# Altium project STM32H743II_V1_18_12.PrjPCB
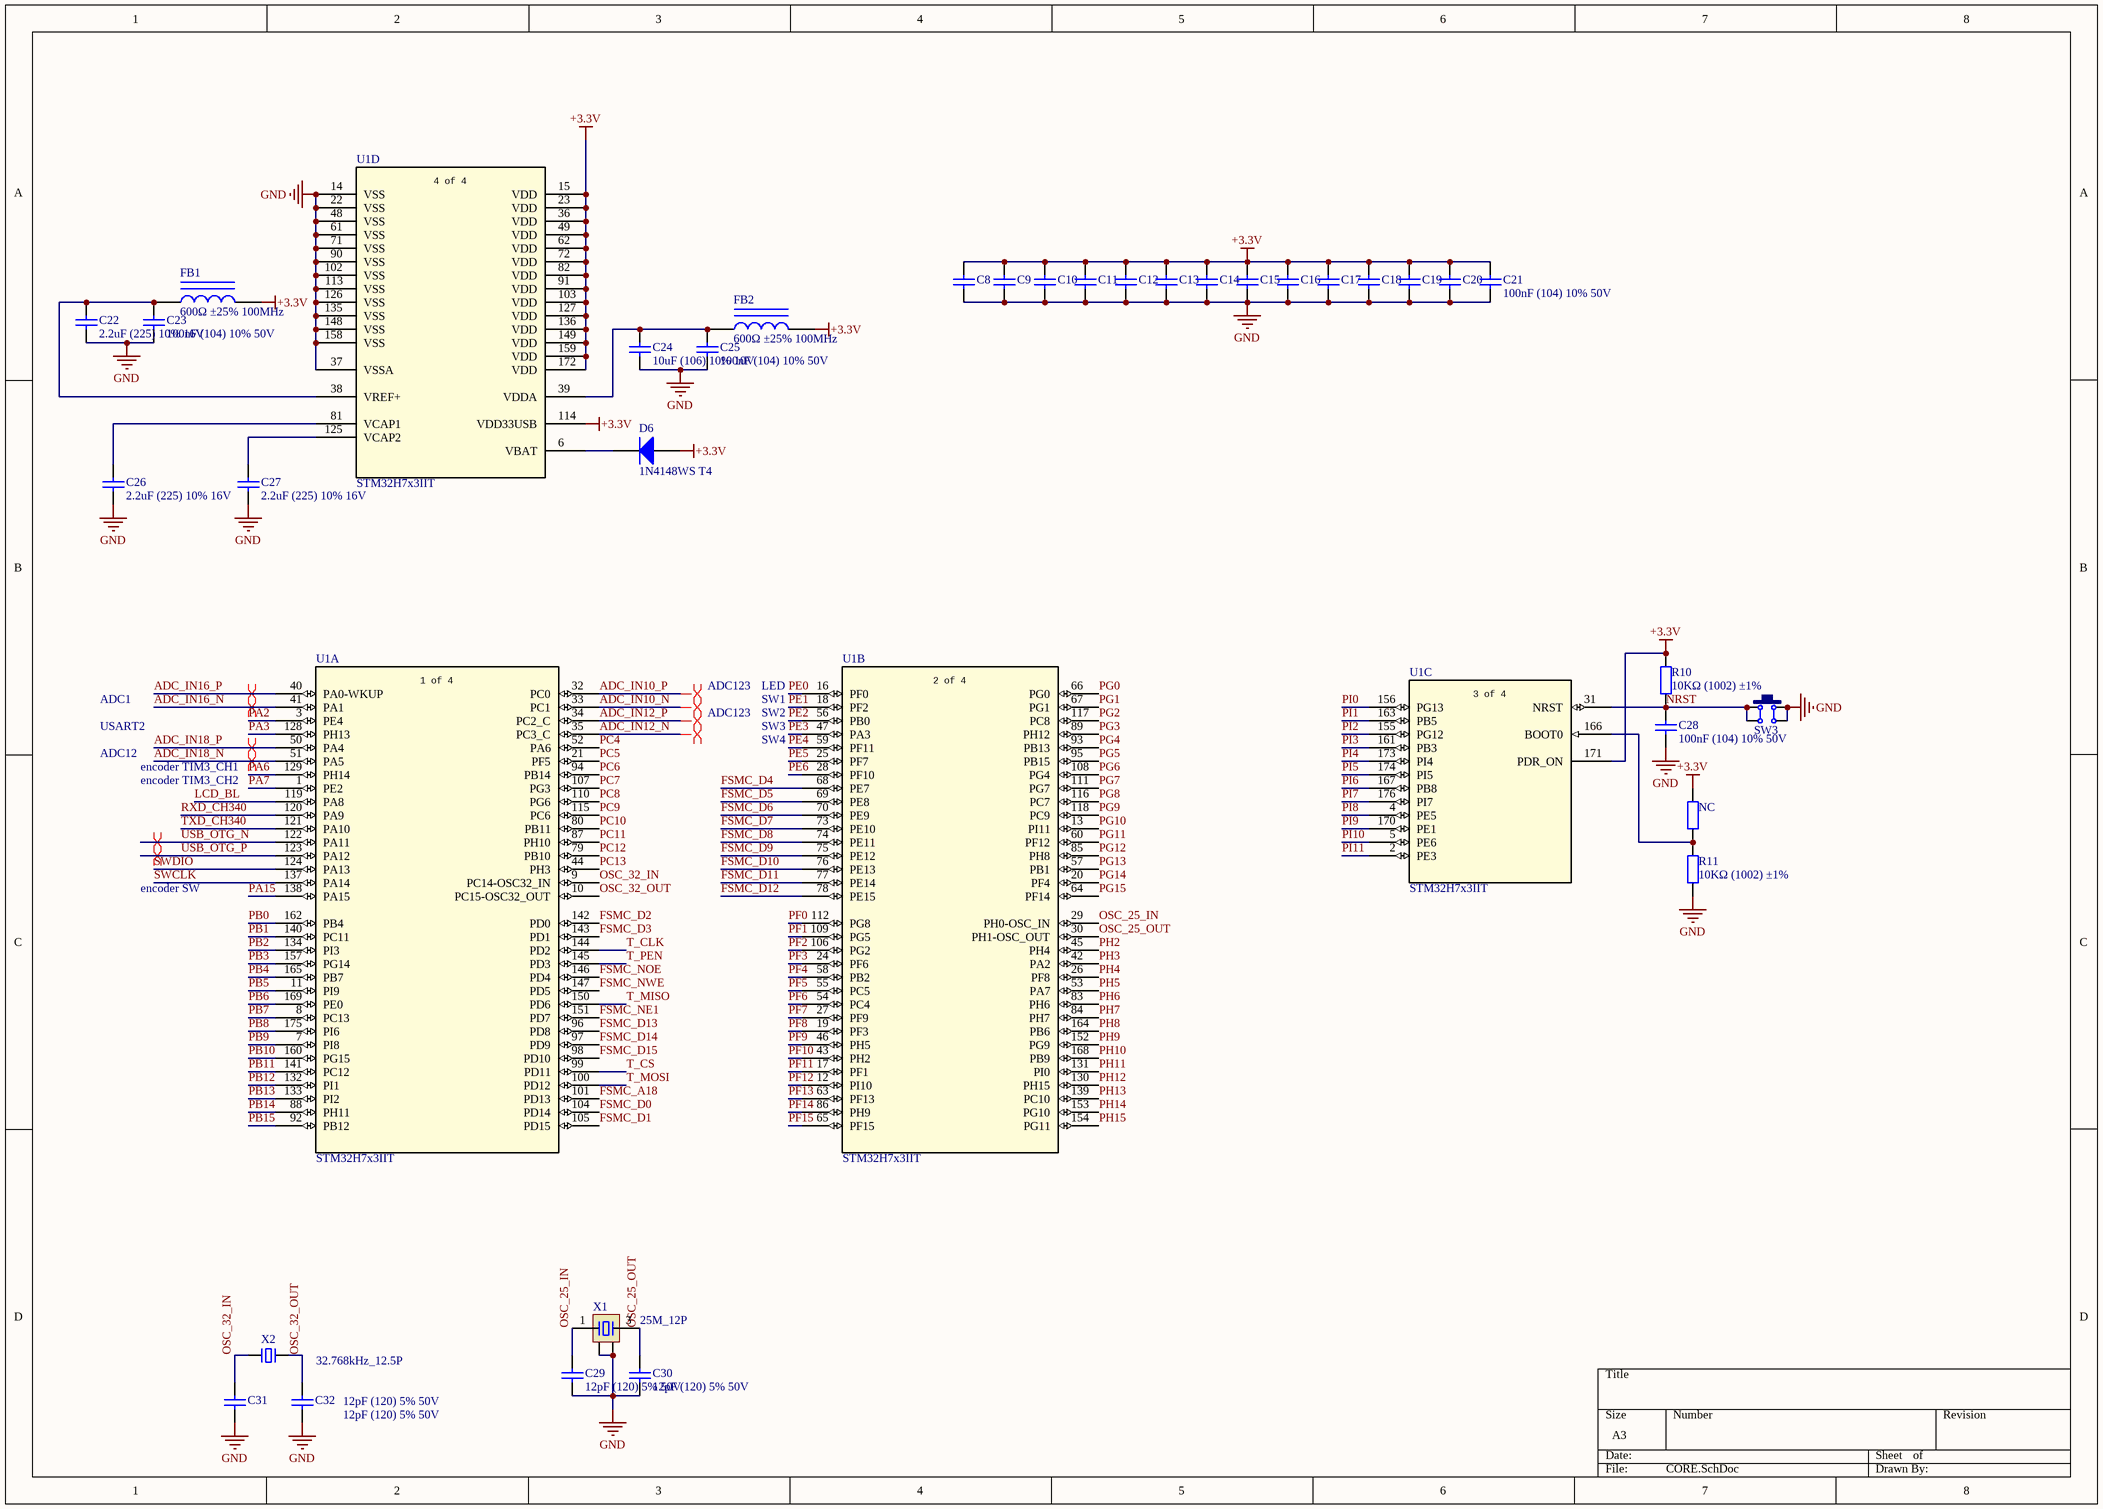
[diagram p0: CORE.SchDoc]
5 sheets, 128 parts. Net scope: global (net labels, ports and power ports of the same name join across sheets).
Board file: STM32H743II.PcbDoc
Sheets:
  CORE.SchDoc
  ST-LINK.SchDoc
  POWER.SchDoc
  CONNECTOR.SchDoc
  DEVICE.SchDoc

## Sheet CORE.SchDoc
size A3

### Parts
C8  100nF (104) 10% 50V  [0603_C]  (value not drawn)
C9  100nF (104) 10% 50V  [0603_C]  (value not drawn)
C10  100nF (104) 10% 50V  [0603_C]  (value not drawn)
C11  100nF (104) 10% 50V  [0603_C]  (value not drawn)
C12  100nF (104) 10% 50V  [0603_C]  (value not drawn)
C13  100nF (104) 10% 50V  [0603_C]  (value not drawn)
C14  100nF (104) 10% 50V  [0603_C]  (value not drawn)
C15  100nF (104) 10% 50V  [0603_C]  (value not drawn)
C16  100nF (104) 10% 50V  [0603_C]  (value not drawn)
C17  100nF (104) 10% 50V  [0603_C]  (value not drawn)
C18  100nF (104) 10% 50V  [0603_C]  (value not drawn)
C19  100nF (104) 10% 50V  [0603_C]  (value not drawn)
C20  100nF (104) 10% 50V  [0603_C]  (value not drawn)
C21  100nF (104) 10% 50V  [0603_C]
C22  2.2uF (225) 10% 16V  [0603_C]
C23  100nF (104) 10% 50V  [0603_C]
C24  10uF (106) 10% 10V  [0603_C]
C25  100nF (104) 10% 50V  [0603_C]
C26  2.2uF (225) 10% 16V  [0603_C]
C27  2.2uF (225) 10% 16V  [0603_C]
C28  100nF (104) 10% 50V  [0603_C]
C29  12pF (120) 5% 50V  [0603_C]
C30  12pF (120) 5% 50V  [0603_C]
C31  12pF (120) 5% 50V  [0603_C]
C32  12pF (120) 5% 50V  [0603_C]
D6  1N4148WS T4  [SOD-323]
FB1  600Ω ±25% 100MHz  [0805_L]
FB2  600Ω ±25% 100MHz  [0805_L]
NC  (no value)  [0603_R]
R10  10KΩ (1002) ±1%  [0603_R]
R11  10KΩ (1002) ±1%  [0603_R]
SW3  6x6x5  [TSW DIP-6*6*6]  (value not drawn)
U1  STM32H7x3IIT  [LQFP176_24x24mm]  (parts A,B,C,D of 4)
X1  25M_12P  [OSC 3225-4P]
X2  32.768kHz_12.5P  [OSC 3215-2P]

### Nets
+3.3V: C8.2 C9.2 C10.2 C11.2 C12.2 C13.2 C14.2 C15.2 C16.2 C17.2 C18.2 C19.2 C20.2 C21.2 D6.1(A) FB1.2 FB2.2 NC.1 R10.2 U1.15(VDD) U1.23(VDD) U1.36(VDD) U1.49(VDD) U1.62(VDD) U1.72(VDD) U1.82(VDD) U1.91(VDD) U1.103(VDD) U1.114(VDD33USB) U1.127(VDD) U1.136(VDD) U1.149(VDD) U1.159(VDD) U1.171(PDR_ON) U1.172(VDD)
GND: C8.1 C9.1 C10.1 C11.1 C12.1 C13.1 C14.1 C15.1 C16.1 C17.1 C18.1 C19.1 C20.1 C21.1 C22.1 C23.1 C24.1 C25.1 C26.1 C27.1 C28.1 C29.1 C30.2 C31.1 C32.1 R11.1 SW3.2 SW3.3 U1.14(VSS) U1.22(VSS) U1.37(VSSA) U1.48(VSS) U1.61(VSS) U1.71(VSS) U1.90(VSS) U1.102(VSS) U1.113(VSS) U1.126(VSS) U1.135(VSS) U1.148(VSS) U1.158(VSS) X1.2 X1.4
ADC_IN10_N: U1.33(PC1)
ADC_IN10_P: U1.32(PC0)
ADC_IN12_N: U1.35(PC3_C)
ADC_IN12_P: U1.34(PC2_C)
ADC_IN16_N: U1.41(PA1)
ADC_IN16_P: U1.40(PA0-WKUP)
ADC_IN18_N: U1.51(PA5)
ADC_IN18_P: U1.50(PA4)
FSMC_A18: U1.101(PD13)
FSMC_D0: U1.104(PD14)
FSMC_D1: U1.105(PD15)
FSMC_D2: U1.142(PD0)
FSMC_D3: U1.143(PD1)
FSMC_D4: U1.68(PE7)
FSMC_D5: U1.69(PE8)
FSMC_D6: U1.70(PE9)
FSMC_D7: U1.73(PE10)
FSMC_D8: U1.74(PE11)
FSMC_D9: U1.75(PE12)
FSMC_D10: U1.76(PE13)
FSMC_D11: U1.77(PE14)
FSMC_D12: U1.78(PE15)
FSMC_D13: U1.96(PD8)
FSMC_D14: U1.97(PD9)
FSMC_D15: U1.98(PD10)
FSMC_NE1: U1.151(PD7)
FSMC_NOE: U1.146(PD4)
FSMC_NWE: U1.147(PD5)
LCD_BL: U1.119(PA8)
NRST: C28.2 R10.1 SW3.1 SW3.4 U1.31(NRST)
OSC_25_IN: C29.2 U1.29(PH0-OSC_IN) X1.1
OSC_25_OUT: C30.1 U1.30(PH1-OSC_OUT) X1.3
OSC_32_IN: C31.2 U1.9(PC14-OSC32_IN) X2.1
OSC_32_OUT: C32.2 U1.10(PC15-OSC32_OUT) X2.2
PA2: U1.3(PE4)
PA3: U1.128(PH13)
PA6: U1.129(PH14)
PA7: U1.1(PE2)
PA15: U1.138(PA15)
PB0: U1.162(PB4)
PB1: U1.140(PC11)
PB2: U1.134(PI3)
PB3: U1.157(PG14)
PB4: U1.165(PB7)
PB5: U1.11(PI9)
PB6: U1.169(PE0)
PB7: U1.8(PC13)
PB8: U1.175(PI6)
PB9: U1.7(PI8)
PB10: U1.160(PG15)
PB11: U1.141(PC12)
PB12: U1.132(PI1)
PB13: U1.133(PI2)
PB14: U1.88(PH11)
PB15: U1.92(PB12)
PC4: U1.52(PA6)
PC5: U1.21(PF5)
PC6: U1.94(PB14)
PC7: U1.107(PG3)
PC8: U1.110(PG6)
PC9: U1.115(PC6)
PC10: U1.80(PB11)
PC11: U1.87(PH10)
PC12: U1.79(PB10)
PC13: U1.44(PH3)
PE0: U1.16(PF0)
PE1: U1.18(PF2)
PE2: U1.56(PB0)
PE3: U1.47(PA3)
PE4: U1.59(PF11)
PE5: U1.25(PF7)
PE6: U1.28(PF10)
PF0: U1.112(PG8)
PF1: U1.109(PG5)
PF2: U1.106(PG2)
PF3: U1.24(PF6)
PF4: U1.58(PB2)
PF5: U1.55(PC5)
PF6: U1.54(PC4)
PF7: U1.27(PF9)
PF8: U1.19(PF3)
PF9: U1.46(PH5)
PF10: U1.43(PH2)
PF11: U1.17(PF1)
PF12: U1.12(PI10)
PF13: U1.63(PF13)
PF14: U1.86(PH9)
PF15: U1.65(PF15)
PG0: U1.66(PG0)
PG1: U1.67(PG1)
PG2: U1.117(PC8)
PG3: U1.89(PH12)
PG4: U1.93(PB13)
PG5: U1.95(PB15)
PG6: U1.108(PG4)
PG7: U1.111(PG7)
PG8: U1.116(PC7)
PG9: U1.118(PC9)
PG10: U1.13(PI11)
PG11: U1.60(PF12)
PG12: U1.85(PH8)
PG13: U1.57(PB1)
PG14: U1.20(PF4)
PG15: U1.64(PF14)
PH2: U1.45(PH4)
PH3: U1.42(PA2)
PH4: U1.26(PF8)
PH5: U1.53(PA7)
PH6: U1.83(PH6)
PH7: U1.84(PH7)
PH8: U1.164(PB6)
PH9: U1.152(PG9)
PH10: U1.168(PB9)
PH11: U1.131(PI0)
PH12: U1.130(PH15)
PH13: U1.139(PC10)
PH14: U1.153(PG10)
PH15: U1.154(PG11)
PI0: U1.156(PG13)
PI1: U1.163(PB5)
PI2: U1.155(PG12)
PI3: U1.161(PB3)
PI4: U1.173(PI4)
PI5: U1.174(PI5)
PI6: U1.167(PB8)
PI7: U1.176(PI7)
PI8: U1.4(PE5)
PI9: U1.170(PE1)
PI10: U1.5(PE6)
PI11: U1.2(PE3)
RXD_CH340: U1.120(PA9)
SWCLK: U1.137(PA14)
SWDIO: U1.124(PA13)
T_CLK: U1.144(PD2)
T_CS: U1.99(PD11)
T_MISO: U1.150(PD6)
T_MOSI: U1.100(PD12)
T_PEN: U1.145(PD3)
TXD_CH340: U1.121(PA10)
USB_OTG_N: U1.122(PA11)
USB_OTG_P: U1.123(PA12)
NetC22_2: C22.2 C23.2 FB1.1 U1.38(VREF+)
NetC24_2: C24.2 C25.2 FB2.1 U1.39(VDDA)
NetC26_2: C26.2 U1.81(VCAP1)
NetC27_2: C27.2 U1.125(VCAP2)
NetD6_2: D6.2(K) U1.6(VBAT)
NetNC_2: NC.2 R11.2 U1.166(BOOT0)

### Layout directives
differential pair: ADC_IN10_N, ADC_IN10_P, ADC_IN12_N, ADC_IN12_P, ADC_IN16_N, ADC_IN16_P, ADC_IN18_N, ADC_IN18_P, USB_OTG_N, USB_OTG_P

### Notes on the sheet
- ADC1
- ADC123
- LED
- SW1
- SW2
- ADC12
- USART2
- encoder TIM3_CH1
- encoder TIM3_CH2
- SW3
- SW4
- encoder SW
- (in symbol STM32H7x3IIT, part A) 1 of 4
- (in symbol STM32H7x3IIT, part B) 2 of 4
- (in symbol STM32H7x3IIT, part C) 3 of 4
- (in symbol STM32H7x3IIT, part D) 4 of 4

### Library data of the parts
C8-C21 C23 C25 C28 = 0603 100nF (104) 10% 50V: 贴片电容; ComponentLink1Description: 供应商链接; ComponentLink1URL: http://www.szlcsc.com/product/details_15331.html; Package: 0603; Supplier: LC; SuppliersPartNumber: C14663
C22 C26 C27 = 0603 2.2uF (225) 10% 16V: 贴片电容; ComponentLink1Description: 供应商链接; ComponentLink1URL: http://www.szlcsc.com/product/details_24366.html; Package: 0603; Supplier: LC; SuppliersPartNumber: C23630
C24 = 0603 10uF (106) 10% 10V: 贴片电容; ComponentLink1Description: 供应商链接; ComponentLink1URL: http://www.szlcsc.com/product/details_20411.html; Package: 0603; Supplier: LC; SuppliersPartNumber: C19702
C29-C32 = 0603 12pF (120) 5% 50V: 贴片电容; ComponentLink1Description: 供应商链接; ComponentLink1URL: http://www.szlcsc.com/product/details_39506.html; Package: 0603; Supplier: LC; SuppliersPartNumber: C38523
D6 = SOD-323 1N4148WS T4: 二极管; ComponentLink1Description: 供应商链接; ComponentLink1URL: http://www.szlcsc.com/product/details_2485.html; Package: SOD-323; Supplier: LC; SuppliersPartNumber: C2128
FB1 FB2 = 0805 600Ω 25% 100MHz: 贴片磁珠; ComponentLink1Description: 供应商链接; ComponentLink1URL: http://www.szlcsc.com/product/details_1369.html; Package: 0805; Supplier: LC; SuppliersPartNumber: C1017
NC = 0603 0Ω (0R0) 1%: 贴片电阻; ComponentLink1Description: 供应商链接; ComponentLink1URL: http://www.szlcsc.com/product/details_21903.html; Package: 0603; Supplier: LC; SuppliersPartNumber: C21189
R10 R11 = 0603 10KΩ (1002) 1%: 贴片电阻; ComponentLink1Description: 供应商链接; ComponentLink1URL: http://www.szlcsc.com/product/details_26547.html; Package: 0603; Supplier: LC; SuppliersPartNumber: C25804
SW3 = TSW DIP-6x6: 直插6x6轻触开关; 版权归属: 源创客; BOM名称: 直插6x6轻触开关; 学习资源: www.ooocke.com
U1 = STM32H7x3IIT: Imported; Vendor: STMicroelectronics; Copyright: Copyright (C) 2016 Accelerated Designs. All rights reserved; Manufacturer_Part_Number: stm32h7x3iit; Value: Value; Type: Type; RefDes: RefDes
X1 = XTAL-4P: 4脚无源晶振; 版权归属: 源创客; BOM名称: 4脚无源晶振; 学习资源: www.ooocke.com
X2 = XTAL-2P: 2脚无源脚晶振; 版权归属: 源创客; BOM名称: 2脚无源脚晶振; 学习资源: www.ooocke.com

## Sheet ST-LINK.SchDoc
size A4
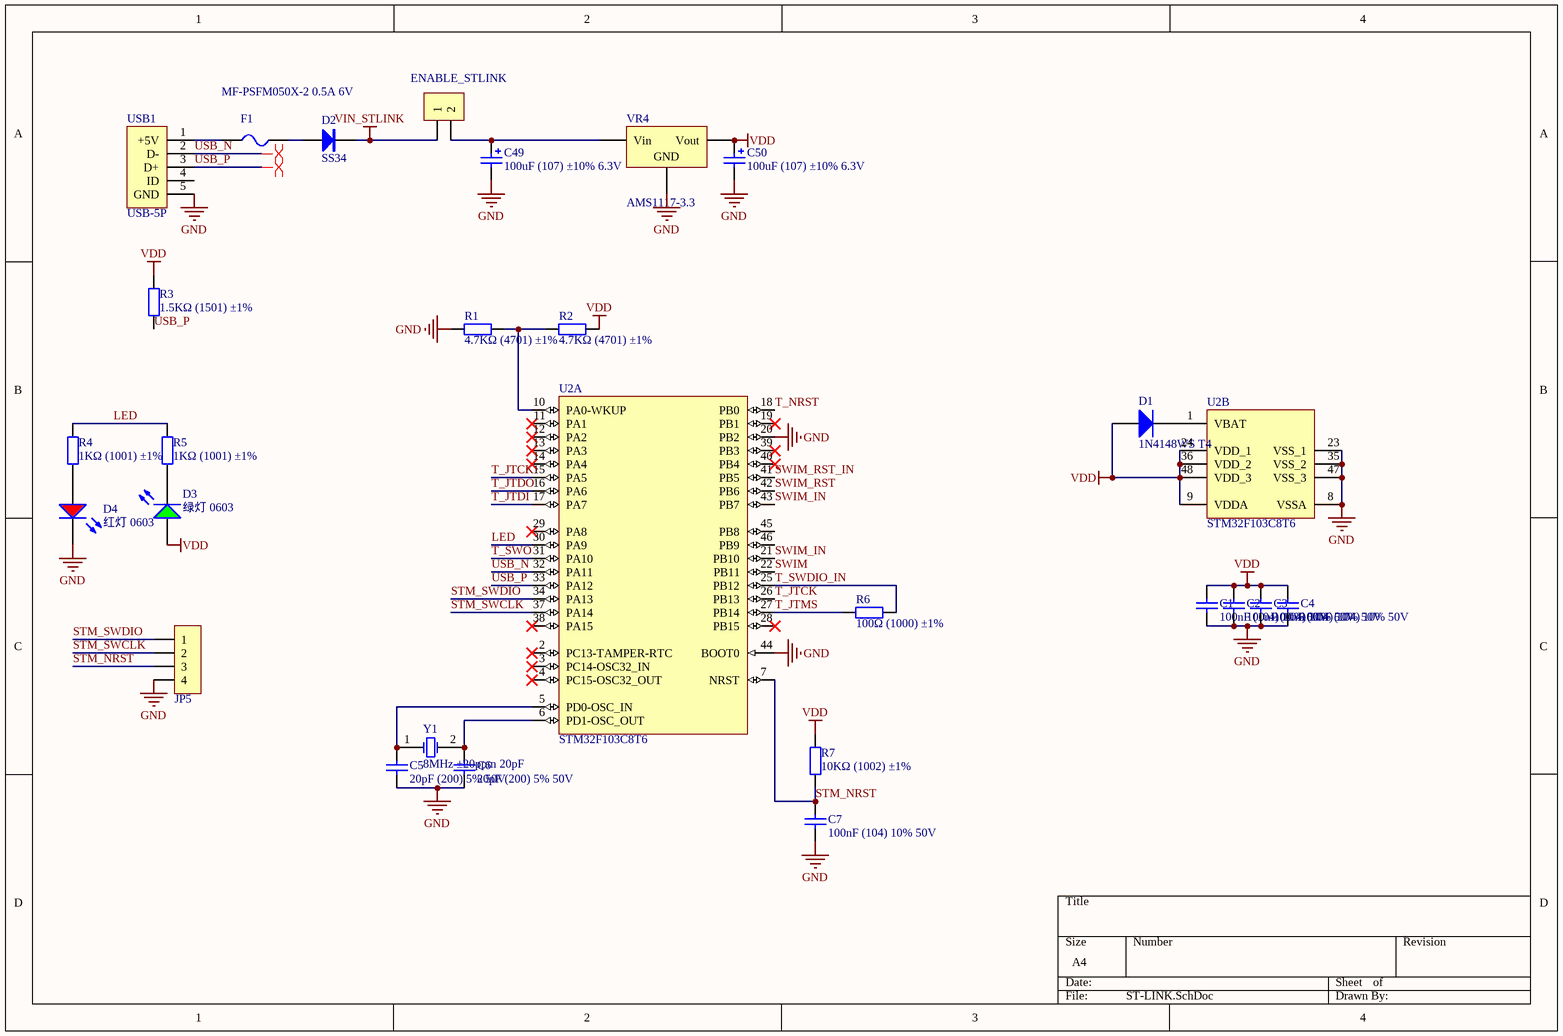
[diagram p1: ST-LINK.SchDoc]

### Parts
C1  100nF (104) 10% 50V  [0603_C]
C2  100nF (104) 10% 50V  [0603_C]
C3  100nF (104) 10% 50V  [0603_C]
C4  100nF (104) 10% 50V  [0603_C]
C5  20pF (200) 5% 50V  [0603_C]
C6  20pF (200) 5% 50V  [0603_C]
C7  100nF (104) 10% 50V  [0603_C]
C49  100uF (107) ±10% 6.3V  [CASE-B_3528]
C50  100uF (107) ±10% 6.3V  [CASE-B_3528]
D1  1N4148WS T4  [SOD-323]
D2  SS34  [SMC]
D3  绿灯 0603  [0603_LED_S1]
D4  红灯 0603  [0603_LED_S1]
ENABLE_STLINK  HDR-1X2  [HDR2.54-LI-2P]  (value not drawn)
F1  MF-PSFM050X-2 0.5A 6V  [FU 0805]
JP5  HDR-1X4  [HDR2.54-LI-4P]  (value not drawn)
R1  4.7KΩ (4701) ±1%  [0603_R]
R2  4.7KΩ (4701) ±1%  [0603_R]
R3  1.5KΩ (1501) ±1%  [0603_R]
R4  1KΩ (1001) ±1%  [0603_R]
R5  1KΩ (1001) ±1%  [0603_R]
R6  100Ω (1000) ±1%  [0603_R]
R7  10KΩ (1002) ±1%  [0603_R]
U2  STM32F103C8T6  [STM-LQFP48_L]  (parts A,B of 2)
USB1  USB-5P  [USB-MICRO_D]
VR4  AMS1117-3.3  [SOT-223]
Y1  8MHz ±20ppm 20pF  [SMD-5032_2P]

### Nets
GND: C1.1 C2.1 C3.1 C4.1 C5.1 C6.1 C7.1 C49.2 C50.2 D4.K JP5.4 R1.1 U2.8(VSSA) U2.20(PB2) U2.23(VSS_1) U2.35(VSS_2) U2.44(BOOT0) U2.47(VSS_3) USB1.5(GND) VR4.1(GND)
VDD: C1.2 C2.2 C3.2 C4.2 C50.1 D1.1(A) D3.A R2.2 R3.2 R7.2 U2.9(VDDA) U2.24(VDD_1) U2.36(VDD_2) U2.48(VDD_3) VR4.2(Vout)
VIN_STLINK: D2.2(K) ENABLE_STLINK.1
LED: R4.2 R5.2 U2.30(PA9)
STM_NRST: C7.2 JP5.3 R7.1 U2.7(NRST)
STM_SWCLK: JP5.2 U2.37(PA14)
STM_SWDIO: JP5.1 U2.34(PA13)
SWIM: U2.22(PB11)
SWIM_IN: U2.21(PB10) U2.43(PB7)
SWIM_RST: U2.42(PB6)
SWIM_RST_IN: U2.41(PB5)
T_JTCK: U2.15(PA5) U2.26(PB13)
T_JTDI: U2.17(PA7)
T_JTDO: U2.16(PA6)
T_JTMS: R6.1 U2.27(PB14)
T_NRST: U2.18(PB0)
T_SWDIO_IN: R6.2 U2.25(PB12)
T_SWO: U2.31(PA10)
USB_N: U2.32(PA11) USB1.2(D-)
USB_P: R3.1 U2.33(PA12) USB1.3(D+)
NetC5_2: C5.2 U2.5(PD0-OSC_IN) Y1.1(OSC1)
NetC6_2: C6.2 U2.6(PD1-OSC_OUT) Y1.2(OSC2)
NetC49_1: C49.1 ENABLE_STLINK.2 VR4.3(Vin)
NetD1_2: D1.2(K) U2.1(VBAT)
NetD2_1: D2.1(A) F1.2
NetD3_K: D3.K R5.1
NetD4_A: D4.A R4.1
NetF1_1: F1.1 USB1.1(+5V)
NetR1_2: R1.2 R2.1 U2.10(PA0-WKUP)

Not connected (* = marked no-connect by the designer): U2 2(PC13-TAMPER-RTC)* 3(PC14-OSC32_IN)* 4(PC15-OSC32_OUT)* 11(PA1)* 12(PA2)* 13(PA3)* 14(PA4)* 19(PB1)* 28(PB15)* 29(PA8)* 38(PA15)* 39(PB3)* 40(PB4)* 45(PB8) 46(PB9); USB1 4(ID)

### Layout directives
differential pair: USB_N, USB_P

### Library data of the parts
C1-C4 C7 = 0603 100nF (104) 10% 50V: 贴片电容; ComponentLink1Description: 供应商链接; ComponentLink1URL: http://www.szlcsc.com/product/details_15331.html; Package: 0603; Supplier: LC; SuppliersPartNumber: C14663
C5 C6 = 0603 20pF (200) 5% 50V: 贴片电容; ComponentLink1Description: 供应商链接; ComponentLink1URL: http://www.szlcsc.com/product/details_2000.html; Package: 0603; Supplier: LC; SuppliersPartNumber: C1648
C49 C50 = 3528 100uF (107) 10% 6.3V: 钽电容; ComponentLink1Description: 供应商链接; ComponentLink1URL: http://www.szlcsc.com/product/details_16815.html; Package: 3528; Supplier: LC; SuppliersPartNumber: C16133
D1 = SOD-323 1N4148WS T4: 二极管; ComponentLink1Description: 供应商链接; ComponentLink1URL: http://www.szlcsc.com/product/details_2485.html; Package: SOD-323; Supplier: LC; SuppliersPartNumber: C2128
D2 = SS34: 肖特基二极管; 版权归属: 源创客; 属性: 40V/3A; BOM名称: 肖特基二极管; 学习资源: www.ooocke.com
D3 = 0603 绿灯: 发光二极管; ComponentLink1Description: 供应商链接; ComponentLink1URL: http://www.szlcsc.com/product/details_73152.html; Package: 0603; Supplier: LC; SuppliersPartNumber: C72043
D4 = 0603 红灯: 发光二极管; ComponentLink1Description: 供应商链接; ComponentLink1URL: http://www.szlcsc.com/product/details_2659.html; Package: 0603; Supplier: LC; SuppliersPartNumber: C2286
ENABLE_STLINK = Header 2: 2P接插件; 版权归属: 源创客; BOM名称: 2P接插件; 学习资源: www.ooocke.com
F1 = FU: 贴片保险丝; 版权归属: 源创客; BOM名称: 贴片保险丝; 学习资源: www.ooocke.com
JP5 = Header 4: 4P接插件; 版权归属: 源创客; BOM名称: 4P接插件; 学习资源: www.ooocke.com
R1 R2 = 0603 4.7KΩ (4701) 1%: 贴片电阻; ComponentLink1Description: 供应商链接; ComponentLink1URL: http://www.szlcsc.com/product/details_23889.html; Package: 0603; Supplier: LC; SuppliersPartNumber: C23162
R3 = 0603 1.5KΩ (1501) 1%: 贴片电阻; ComponentLink1Description: 供应商链接; ComponentLink1URL: http://www.szlcsc.com/product/details_23570.html; Package: 0603; Supplier: LC; SuppliersPartNumber: C22843
R4 R5 = 0603 1KΩ (1001) 1%: 贴片电阻; ComponentLink1Description: 供应商链接; ComponentLink1URL: http://www.szlcsc.com/product/details_21904.html; Package: 0603; Supplier: LC; SuppliersPartNumber: C21190
R6 = 0603 100Ω (1000) 1%: 贴片电阻; ComponentLink1Description: 供应商链接; ComponentLink1URL: http://www.szlcsc.com/product/details_23502.html; Package: 0603; Supplier: LC; SuppliersPartNumber: C22775
R7 = 0603 10KΩ (1002) 1%: 贴片电阻; ComponentLink1Description: 供应商链接; ComponentLink1URL: http://www.szlcsc.com/product/details_26547.html; Package: 0603; Supplier: LC; SuppliersPartNumber: C25804
U2 = CMP-0237-00215-3: ARM Cortex-M3 32-bit MCU, 64 KB Flash, 20 KB Internal RAM, 37 I/Os, 48-pin LQFP, -40 to 85 degC, Tray; Supply Voltage(Vcc) min (V): 2; Internal RAM Size (kB): 20; FLASH Size (Prog) (kB): 64; A/D Converter: 2x12-bit (10 Channel); I/Os (High Current): 37; Operating Frequency(F) (Processor speed) (MHz): 72; Core: ARM Cortex-M3; ComponentLink3Description: Package Specification; Mounting Technology: Surface Mount; PartNumber: STM32F103C8T6; PackageReference: LQFP48; Packing: Tray; ComponentLink3URL: http://www.st.com/st-web-ui/static/active/en/resource/technical/document/datasheet/DM00058181.pdf; DatasheetVersion: Rev. 16; ComponentLink1URL: http://www.st.com/web/en/home.html; PackageVersion: Rev. 6, 06/2013; ComponentLink2URL: http://www.st.com/st-web-ui/static/active/en/resource/technical/document/datasheet/CD00161566.pdf; ComponentLink1Description: Manufacturer URL; ComponentLink2Description: Datasheet; PackageDescription: 48-Pin Low Profile Quad Flat Package, 7 x 7 mm Body, 0.5 mm Pitch; PartId: 1
USB1 = USB-5P: 微型USB母座; 版权归属: 源创客; BOM名称: 微型USB母座; 学习资源: www.ooocke.com
VR4 = SOT-223 AMS1117-3.3: 低压差线性稳压(LDO); ComponentLink1Description: 供应商链接; ComponentLink1URL: http://www.szlcsc.com/product/details_6652.html; Package: SOT-223; Supplier: LC; SuppliersPartNumber: C6186
Y1 = SMD-5032_2P 8MHz 20ppm 20pF: 贴片晶振; ComponentLink1Description: 供应商链接; ComponentLink1URL: http://www.szlcsc.com/product/details_117214.html; Package: SMD-5032_2P; Supplier: LC; SuppliersPartNumber: C115962

## Sheet POWER.SchDoc
size A4
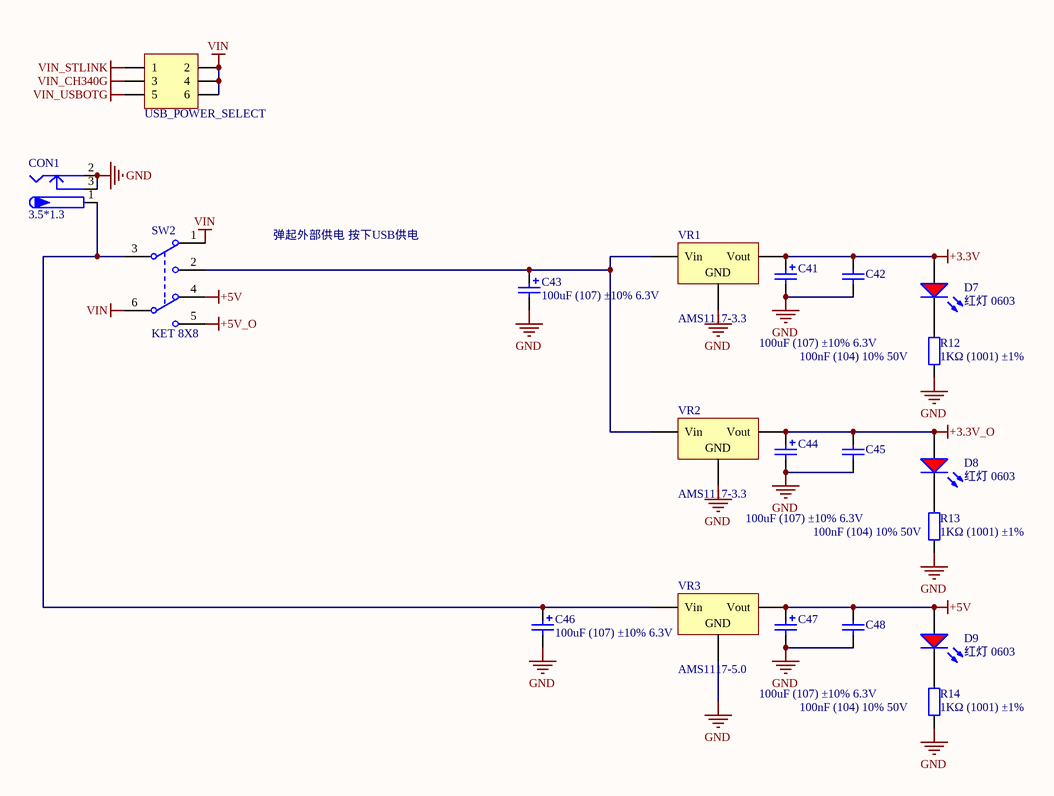
[diagram p2: POWER.SchDoc]

### Parts
C41  100uF (107) ±10% 6.3V  [CASE-B_3528]
C42  100nF (104) 10% 50V  [0603_C]
C43  100uF (107) ±10% 6.3V  [CASE-B_3528]
C44  100uF (107) ±10% 6.3V  [CASE-B_3528]
C45  100nF (104) 10% 50V  [0603_C]
C46  100uF (107) ±10% 6.3V  [CASE-B_3528]
C47  100uF (107) ±10% 6.3V  [CASE-B_3528]
C48  100nF (104) 10% 50V  [0603_C]
CON1  3.5*1.3  [DC-005]
D7  红灯 0603  [0603_LED_S1]
D8  红灯 0603  [0603_LED_S1]
D9  红灯 0603  [0603_LED_S1]
R12  1KΩ (1001) ±1%  [0603_R]
R13  1KΩ (1001) ±1%  [0603_R]
R14  1KΩ (1001) ±1%  [0603_R]
SW2  KET 8X8  [KFT DIP-8X8]
USB_POWER_SELECT  Header3X2  [HDR2.54-LI-2x3P]  (value not drawn)
VR1  AMS1117-3.3  [SOT-223]
VR2  AMS1117-3.3  [SOT-223]
VR3  AMS1117-5.0  [SOT-223]

### Nets
+3.3V: C41.1 C42.2 D7.A VR1.2(Vout)
+3.3V_O: C44.1 C45.2 D8.A VR2.2(Vout)
+5V: C47.1 C48.2 D9.A SW2.4(NO2) VR3.2(Vout)
+5V_O: SW2.5(COM2)
GND: C41.2 C42.1 C43.2 C44.2 C45.1 C46.2 C47.2 C48.1 CON1.2 CON1.3 R12.1 R13.1 R14.1 VR1.1(GND) VR2.1(GND) VR3.1(GND)
VIN: SW2.1(NC1) SW2.6(NC2) USB_POWER_SELECT.2 USB_POWER_SELECT.4 USB_POWER_SELECT.6
VIN_CH340G: USB_POWER_SELECT.3
VIN_STLINK: USB_POWER_SELECT.1
VIN_USBOTG: USB_POWER_SELECT.5
NetC43_1: C43.1 SW2.2(COM2) VR1.3(Vin) VR2.3(Vin)
NetC46_1: C46.1 CON1.1 SW2.3(NO1) VR3.3(Vin)
NetD7_K: D7.K R12.2
NetD8_K: D8.K R13.2
NetD9_K: D9.K R14.2

### Notes on the sheet
- 弹起外部供电 按下USB供电

### Library data of the parts
C41 C43 C44 C46 C47 = 3528 100uF (107) 10% 6.3V: 钽电容; ComponentLink1Description: 供应商链接; ComponentLink1URL: http://www.szlcsc.com/product/details_16815.html; Package: 3528; Supplier: LC; SuppliersPartNumber: C16133
C42 C45 C48 = 0603 100nF (104) 10% 50V: 贴片电容; ComponentLink1Description: 供应商链接; ComponentLink1URL: http://www.szlcsc.com/product/details_15331.html; Package: 0603; Supplier: LC; SuppliersPartNumber: C14663
CON1 = P-DC: 低压电源接口; BOM名称: DC电源接口; 版权归属: 源创客; 学习资源: www.ooocke.com
D7-D9 = 0603 红灯: 发光二极管; ComponentLink1Description: 供应商链接; ComponentLink1URL: http://www.szlcsc.com/product/details_2659.html; Package: 0603; Supplier: LC; SuppliersPartNumber: C2286
R12-R14 = 0603 1KΩ (1001) 1%: 贴片电阻; ComponentLink1Description: 供应商链接; ComponentLink1URL: http://www.szlcsc.com/product/details_21904.html; Package: 0603; Supplier: LC; SuppliersPartNumber: C21190
SW2 = KET 8X8: 8*8自锁开关; 版权归属: 源创客; BOM名称: 8*8自锁开关; 学习资源: www.ooocke.com
USB_POWER_SELECT = Header 3X2: 3*2P接插件; 版权归属: 源创客; BOM名称: 3*2P接插件; 学习资源: www.ooocke.com
VR1 VR2 = SOT-223 AMS1117-3.3: 低压差线性稳压(LDO); ComponentLink1Description: 供应商链接; ComponentLink1URL: http://www.szlcsc.com/product/details_6652.html; Package: SOT-223; Supplier: LC; SuppliersPartNumber: C6186
VR3 = SOT-223 AMS1117-5.0: 低压差线性稳压(LDO); ComponentLink1Description: 供应商链接; ComponentLink1URL: http://www.szlcsc.com/product/details_6653.html; Package: SOT-223; Supplier: LC; SuppliersPartNumber: C6187

## Sheet CONNECTOR.SchDoc
size A4
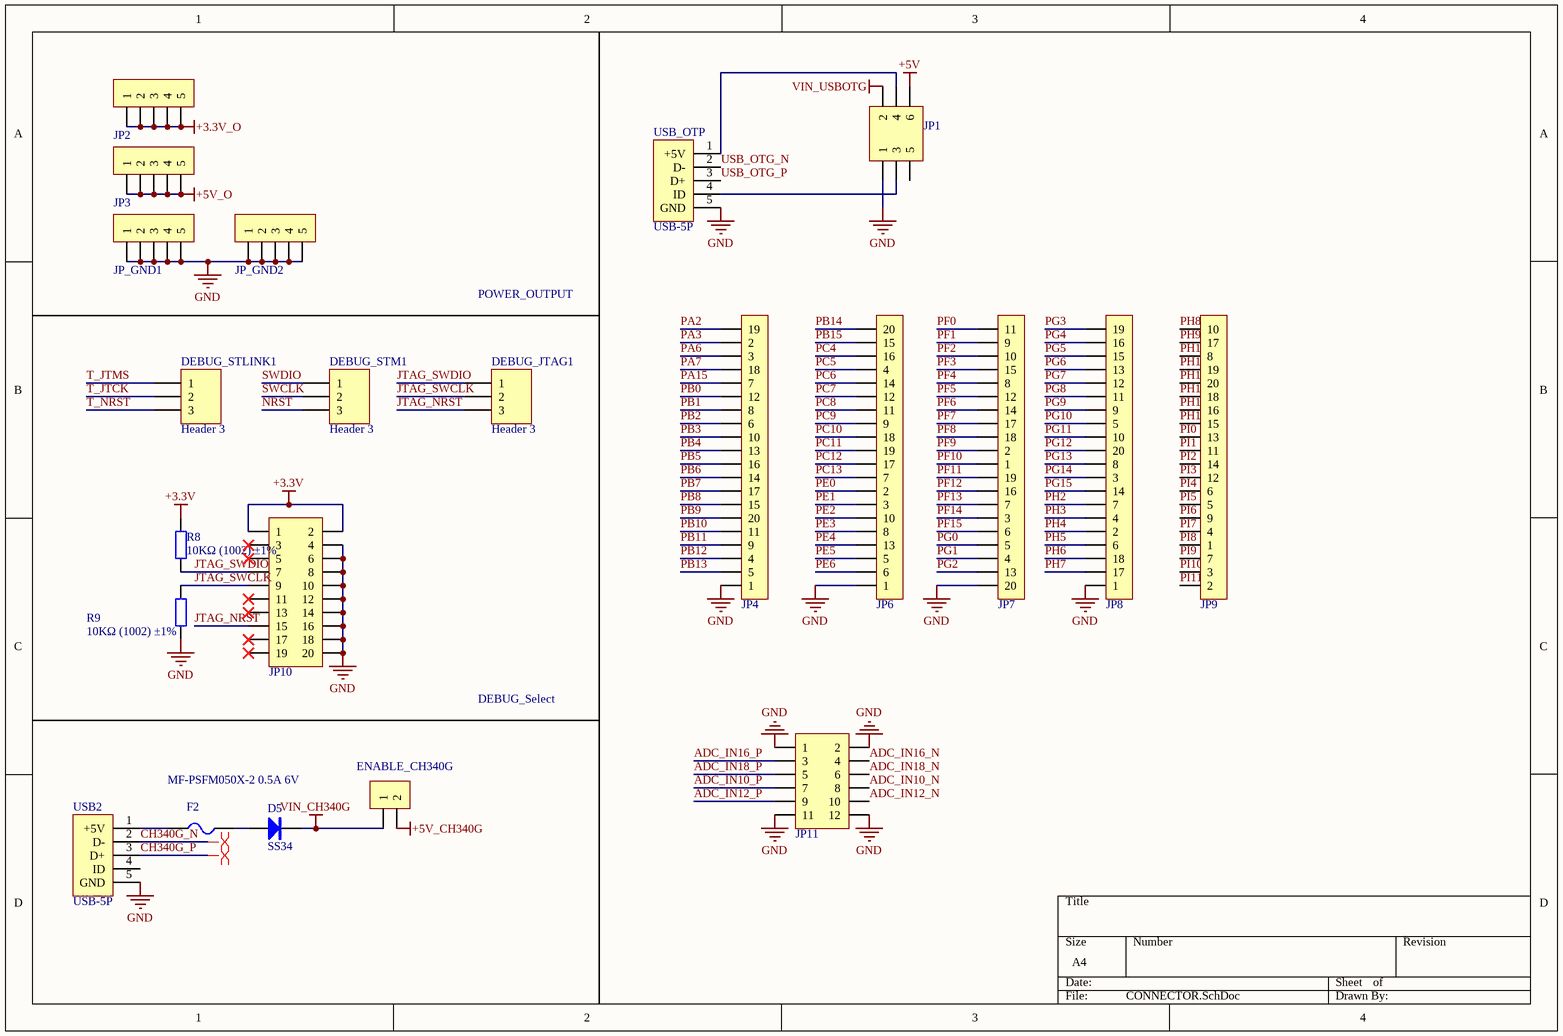
[diagram p3: CONNECTOR.SchDoc]

### Parts
D5  SS34  [SMC]
DEBUG_JTAG1  Header 3  [HDR1X3]
DEBUG_STLINK1  Header 3  [HDR1X3]
DEBUG_STM1  Header 3  [HDR1X3]
ENABLE_CH340G  HDR-1X2  [HDR2.54-LI-2P]  (value not drawn)
F2  MF-PSFM050X-2 0.5A 6V  [FU 0805]
JP1  Header3X2  [HDR2.54-LI-2x3P]  (value not drawn)
JP2  HDR-1X5  [HDR2.54-LI-5P]  (value not drawn)
JP3  HDR-1X5  [HDR2.54-LI-5P]  (value not drawn)
JP4  HDR-1X20  [HDR2.54-LI-20P]  (value not drawn)
JP6  HDR-1X20  [HDR2.54-LI-20P]  (value not drawn)
JP7  HDR-1X20  [HDR2.54-LI-20P]  (value not drawn)
JP8  HDR-1X20  [HDR2.54-LI-20P]  (value not drawn)
JP9  HDR-1X20  [HDR2.54-LI-20P]  (value not drawn)
JP10  Header 2X10  [IDC2.54-LI-2x10P]  (value not drawn)
JP11  Header 6X2  [HDR2.54-LI-2x6P]  (value not drawn)
JP_GND1  HDR-1X5  [HDR2.54-LI-5P]  (value not drawn)
JP_GND2  HDR-1X5  [HDR2.54-LI-5P]  (value not drawn)
R8  10KΩ (1002) ±1%  [0603_R]
R9  10KΩ (1002) ±1%  [0603_R]
USB2  USB-5P  [USB-MICRO_D]
USB_OTP  USB-5P  [USB-MICRO_D]

### Nets
+3.3V: JP10.1 JP10.2 R8.2
+3.3V_O: JP2.1 JP2.2 JP2.3 JP2.4 JP2.5
+5V: JP1.6
+5V_CH340G: ENABLE_CH340G.2
+5V_O: JP3.1 JP3.2 JP3.3 JP3.4 JP3.5
GND: JP1.1 JP4.1 JP6.1 JP7.20 JP8.1 JP10.4 JP10.6 JP10.8 JP10.10 JP10.12 JP10.14 JP10.16 JP10.18 JP10.20 JP11.1 JP11.2 JP11.11 JP11.12 JP_GND1.1 JP_GND1.2 JP_GND1.3 JP_GND1.4 JP_GND1.5 JP_GND2.1 JP_GND2.2 JP_GND2.3 JP_GND2.4 JP_GND2.5 R9.1 USB2.5(GND) USB_OTP.5(GND)
VIN_CH340G: D5.2(K) ENABLE_CH340G.1
VIN_USBOTG: JP1.2
ADC_IN10_N: JP11.8
ADC_IN10_P: JP11.7
ADC_IN12_N: JP11.10
ADC_IN12_P: JP11.9
ADC_IN16_N: JP11.4
ADC_IN16_P: JP11.3
ADC_IN18_N: JP11.6
ADC_IN18_P: JP11.5
CH340G_N: USB2.2(D-)
CH340G_P: USB2.3(D+)
JTAG_NRST: DEBUG_JTAG1.3 JP10.15
JTAG_SWCLK: DEBUG_JTAG1.2 JP10.9 R9.2
JTAG_SWDIO: DEBUG_JTAG1.1 JP10.7 R8.1
NRST: DEBUG_STM1.3
PA2: JP4.19
PA3: JP4.2
PA6: JP4.3
PA7: JP4.18
PA15: JP4.7
PB0: JP4.12
PB1: JP4.8
PB2: JP4.6
PB3: JP4.10
PB4: JP4.13
PB5: JP4.16
PB6: JP4.14
PB7: JP4.17
PB8: JP4.15
PB9: JP4.20
PB10: JP4.11
PB11: JP4.9
PB12: JP4.4
PB13: JP4.5
PB14: JP6.20
PB15: JP6.15
PC4: JP6.16
PC5: JP6.4
PC6: JP6.14
PC7: JP6.12
PC8: JP6.11
PC9: JP6.9
PC10: JP6.18
PC11: JP6.19
PC12: JP6.17
PC13: JP6.7
PE0: JP6.2
PE1: JP6.3
PE2: JP6.10
PE3: JP6.8
PE4: JP6.13
PE5: JP6.5
PE6: JP6.6
PF0: JP7.11
PF1: JP7.9
PF2: JP7.10
PF3: JP7.15
PF4: JP7.8
PF5: JP7.12
PF6: JP7.14
PF7: JP7.17
PF8: JP7.18
PF9: JP7.2
PF10: JP7.1
PF11: JP7.19
PF12: JP7.16
PF13: JP7.7
PF14: JP7.3
PF15: JP7.6
PG0: JP7.5
PG1: JP7.4
PG2: JP7.13
PG3: JP8.19
PG4: JP8.16
PG5: JP8.15
PG6: JP8.13
PG7: JP8.12
PG8: JP8.11
PG9: JP8.9
PG10: JP8.5
PG11: JP8.10
PG12: JP8.20
PG13: JP8.8
PG14: JP8.3
PG15: JP8.14
PH2: JP8.7
PH3: JP8.4
PH4: JP8.2
PH5: JP8.6
PH6: JP8.18
PH7: JP8.17
PH8: JP9.10
PH9: JP9.17
PH10: JP9.8
PH11: JP9.19
PH12: JP9.20
PH13: JP9.18
PH14: JP9.16
PH15: JP9.15
PI0: JP9.13
PI1: JP9.11
PI2: JP9.14
PI3: JP9.12
PI4: JP9.6
PI5: JP9.5
PI6: JP9.9
PI7: JP9.4
PI8: JP9.1
PI9: JP9.7
PI10: JP9.3
PI11: JP9.2
SWCLK: DEBUG_STM1.2
SWDIO: DEBUG_STM1.1
T_JTCK: DEBUG_STLINK1.2
T_JTMS: DEBUG_STLINK1.1
T_NRST: DEBUG_STLINK1.3
USB_OTG_N: USB_OTP.2(D-)
USB_OTG_P: USB_OTP.3(D+)
NetD5_1: D5.1(A) F2.2
NetF2_1: F2.1 USB2.1(+5V)
NetJP1_3: JP1.3 USB_OTP.4(ID)
NetJP1_4: JP1.4 USB_OTP.1(+5V)

Not connected (* = marked no-connect by the designer): JP1 5; JP10 3* 5* 11* 13* 17* 19*; USB2 4(ID)

### Layout directives
differential pair: CH340G_N, CH340G_P

### Notes on the sheet
- POWER_OUTPUT
- DEBUG_Select

### Library data of the parts
D5 = SS34: 肖特基二极管; 版权归属: 源创客; 属性: 40V/3A; BOM名称: 肖特基二极管; 学习资源: www.ooocke.com
DEBUG_JTAG1 DEBUG_STLINK1 DEBUG_STM1 = Header 3: Header, 3-Pin; LatestRevisionDate: 17-Jul-2002; LatestRevisionNote: Re-released for DXP Platform.; Publisher: Altium Limited
ENABLE_CH340G = Header 2: 2P接插件; 版权归属: 源创客; BOM名称: 2P接插件; 学习资源: www.ooocke.com
F2 = FU: 贴片保险丝; 版权归属: 源创客; BOM名称: 贴片保险丝; 学习资源: www.ooocke.com
JP1 = Header 3X2: 3*2P接插件; 版权归属: 源创客; BOM名称: 3*2P接插件; 学习资源: www.ooocke.com
JP2 JP3 JP_GND1 JP_GND2 = Header 5: 5P接插件; 版权归属: 源创客; BOM名称: 5P接插件; 学习资源: www.ooocke.com
JP4 JP6-JP9 = Header 20: 20P接插件; 版权归属: 源创客; BOM名称: 20P接插件; 学习资源: www.ooocke.com
JP10 = Header 10X2: 10*2P接插件; 版权归属: 源创客; BOM名称: 10*2P接插件; 学习资源: www.ooocke.com
JP11 = Header  6X2: 6*2P接插件; 版权归属: 源创客; BOM名称: 6*2P接插件; 学习资源: www.ooocke.com
R8 R9 = 0603 10KΩ (1002) 1%: 贴片电阻; ComponentLink1Description: 供应商链接; ComponentLink1URL: http://www.szlcsc.com/product/details_26547.html; Package: 0603; Supplier: LC; SuppliersPartNumber: C25804
USB2 USB_OTP = USB-5P: 微型USB母座; 版权归属: 源创客; BOM名称: 微型USB母座; 学习资源: www.ooocke.com

## Sheet DEVICE.SchDoc
size A4
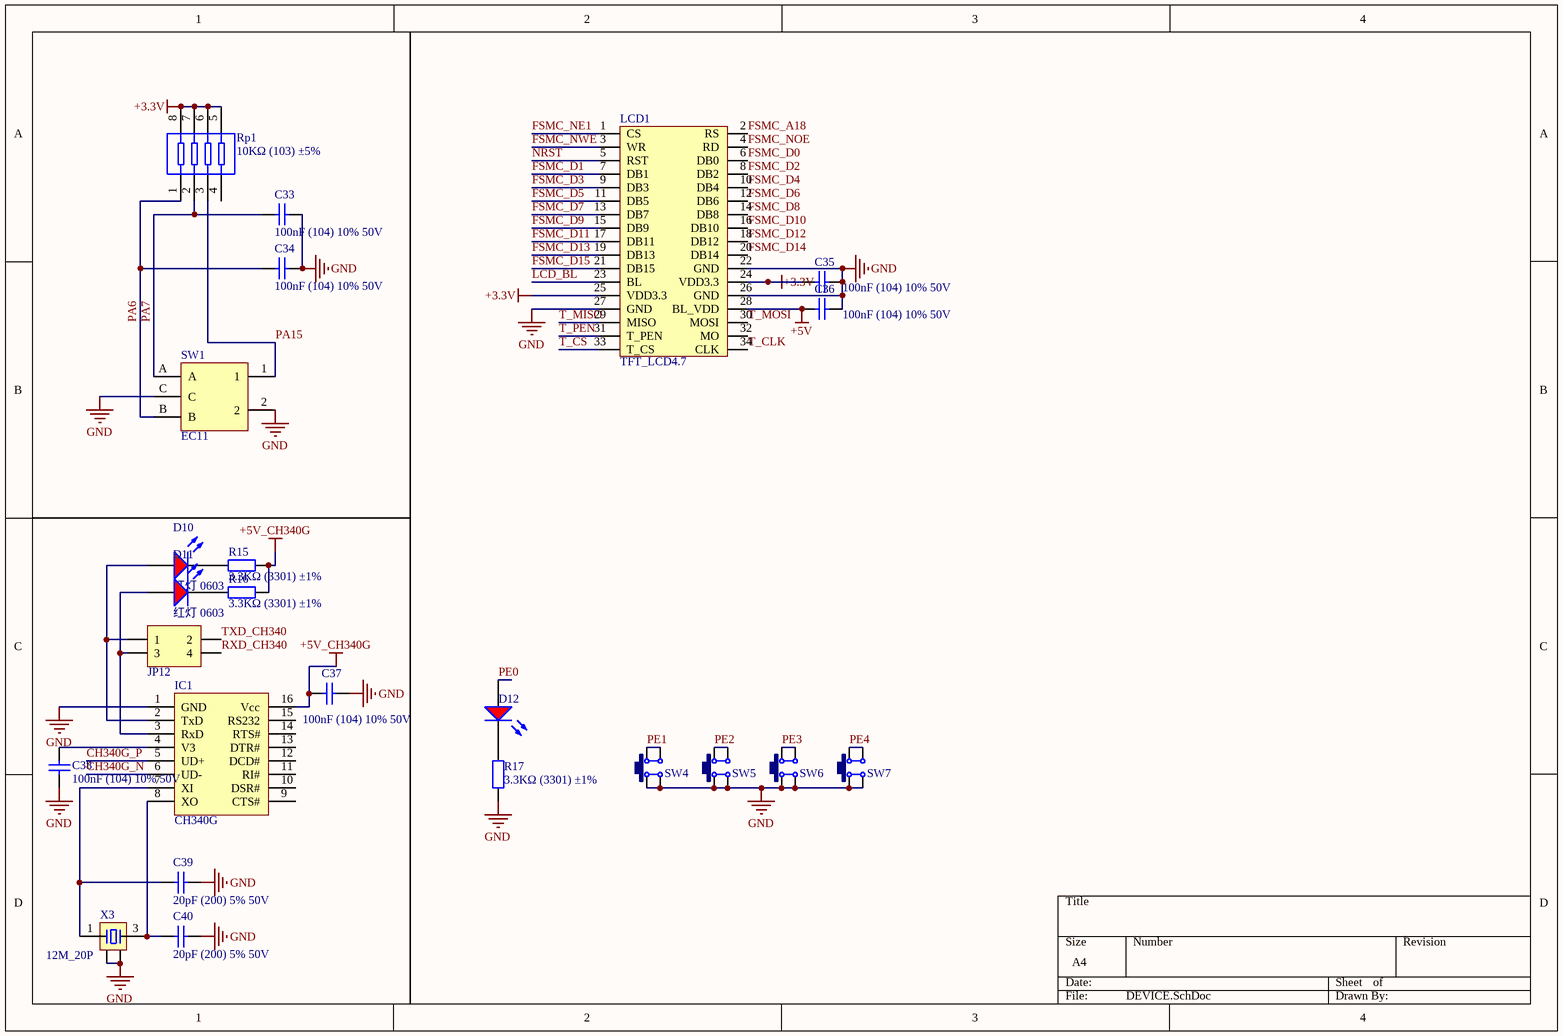
[diagram p4: DEVICE.SchDoc]

### Parts
C33  100nF (104) 10% 50V  [0603_C]
C34  100nF (104) 10% 50V  [0603_C]
C35  100nF (104) 10% 50V  [0603_C]
C36  100nF (104) 10% 50V  [0603_C]
C37  100nF (104) 10% 50V  [0603_C]
C38  100nF (104) 10% 50V  [0603_C]
C39  20pF (200) 5% 50V  [0603_C]
C40  20pF (200) 5% 50V  [0603_C]
D10  红灯 0603  [0603_LED_S1]
D11  红灯 0603  [0603_LED_S1]
D12  红灯 0603  [0603_LED_S1]  (value not drawn)
IC1  CH340G  [SOP16_L]
JP12  Header2X2  [HDR2.54-LI-2x2P]  (value not drawn)
LCD1  TFT_LCD4.7  [DB2*17-3.5]
R15  3.3KΩ (3301) ±1%  [0603_R]
R16  3.3KΩ (3301) ±1%  [0603_R]
R17  3.3KΩ (3301) ±1%  [0603_R]
Rp1  10KΩ (103) ±5%  [0603_Rx4]
SW1  EC11  [EC11-B]
SW4  6x6x5  [TSW DIP-6*6*6]  (value not drawn)
SW5  6x6x5  [TSW DIP-6*6*6]  (value not drawn)
SW6  6x6x5  [TSW DIP-6*6*6]  (value not drawn)
SW7  6x6x5  [TSW DIP-6*6*6]  (value not drawn)
X3  12M_20P  [OSC 3225-4P]

### Nets
+3.3V: C35.1 LCD1.24(VDD3.3) LCD1.25(VDD3.3) Rp1.5 Rp1.6 Rp1.7 Rp1.8
+5V: C36.2 LCD1.28(BL_VDD)
+5V_CH340G: C37.1 IC1.16(Vcc) R15.2 R16.2
GND: C33.1 C34.1 C35.2 C36.1 C37.2 C38.2 C39.1 C40.1 IC1.1(GND) LCD1.22(GND) LCD1.26(GND) LCD1.27(GND) R17.1 SW1.2 SW1.C SW4.1 SW4.4 SW5.1 SW5.4 SW6.1 SW6.4 SW7.1 SW7.4 X3.2 X3.4
CH340G_N: IC1.6(UD-)
CH340G_P: IC1.5(UD+)
FSMC_A18: LCD1.2(RS)
FSMC_D0: LCD1.6(DB0)
FSMC_D1: LCD1.7(DB1)
FSMC_D2: LCD1.8(DB2)
FSMC_D3: LCD1.9(DB3)
FSMC_D4: LCD1.10(DB4)
FSMC_D5: LCD1.11(DB5)
FSMC_D6: LCD1.12(DB6)
FSMC_D7: LCD1.13(DB7)
FSMC_D8: LCD1.14(DB8)
FSMC_D9: LCD1.15(DB9)
FSMC_D10: LCD1.16(DB10)
FSMC_D11: LCD1.17(DB11)
FSMC_D12: LCD1.18(DB12)
FSMC_D13: LCD1.19(DB13)
FSMC_D14: LCD1.20(DB14)
FSMC_D15: LCD1.21(DB15)
FSMC_NE1: LCD1.1(CS)
FSMC_NOE: LCD1.4(RD)
FSMC_NWE: LCD1.3(WR)
LCD_BL: LCD1.23(BL)
NRST: LCD1.5(RST)
PA6: C34.2 Rp1.1 SW1.B
PA7: C33.2 Rp1.2 SW1.A
PA15: Rp1.3 SW1.1
PE0: D12.A
PE1: SW4.2 SW4.3
PE2: SW5.2 SW5.3
PE3: SW6.2 SW6.3
PE4: SW7.2 SW7.3
RXD_CH340: JP12.4
T_CLK: LCD1.34(CLK)
T_CS: LCD1.33(T_CS)
T_MISO: LCD1.29(MISO)
T_MOSI: LCD1.30(MOSI)
T_PEN: LCD1.31(T_PEN)
TXD_CH340: JP12.2
NetC38_1: C38.1 IC1.4(V3)
NetC39_2: C39.2 IC1.7(XI) X3.1
NetC40_2: C40.2 IC1.8(XO) X3.3
NetD10_A: D10.A IC1.2(TxD) JP12.1
NetD10_K: D10.K R15.1
NetD11_A: D11.A IC1.3(RxD) JP12.3
NetD11_K: D11.K R16.1
NetD12_K: D12.K R17.2

Not connected (* = marked no-connect by the designer): IC1 9(CTS#) 10(DSR#) 11(RI#) 12(DCD#) 13(DTR#) 14(RTS#) 15(RS232); LCD1 32(MO); Rp1 4

### Library data of the parts
C33-C38 = 0603 100nF (104) 10% 50V: 贴片电容; ComponentLink1Description: 供应商链接; ComponentLink1URL: http://www.szlcsc.com/product/details_15331.html; Package: 0603; Supplier: LC; SuppliersPartNumber: C14663
C39 C40 = 0603 20pF (200) 5% 50V: 贴片电容; ComponentLink1Description: 供应商链接; ComponentLink1URL: http://www.szlcsc.com/product/details_2000.html; Package: 0603; Supplier: LC; SuppliersPartNumber: C1648
D10-D12 = 0603 红灯: 发光二极管; ComponentLink1Description: 供应商链接; ComponentLink1URL: http://www.szlcsc.com/product/details_2659.html; Package: 0603; Supplier: LC; SuppliersPartNumber: C2286
IC1 = CH340G: 串口转USB; 版权归属: 源创客; BOM名称: 串口转USB; 学习资源: www.ooocke.com
JP12 = Header 2X2: 2*2P接插件; 版权归属: 源创客; BOM名称: 2*2P接插件; 学习资源: www.ooocke.com
R15-R17 = 0603 3.3KΩ (3301) 1%: 贴片电阻; ComponentLink1Description: 供应商链接; ComponentLink1URL: http://www.szlcsc.com/product/details_23705.html; Package: 0603; Supplier: LC; SuppliersPartNumber: C22978
Rp1 = 0603*4  10KΩ (103) 5%: 贴片排阻; ComponentLink1Description: 供应商链接; ComponentLink1URL: http://www.szlcsc.com/product/details_30472.html; Package: 0603*4; Supplier: LC; SuppliersPartNumber: C29718
SW1 = EC11: 数字开关编码器; BOM名称: 数字编码开关; 版权归属: 源创客; 学习资源: www.ooocke.com
SW4-SW7 = TSW DIP-6x6: 直插6x6轻触开关; 版权归属: 源创客; BOM名称: 直插6x6轻触开关; 学习资源: www.ooocke.com
X3 = XTAL-4P: 4脚无源晶振; 版权归属: 源创客; BOM名称: 4脚无源晶振; 学习资源: www.ooocke.com

## Nets that join several sheets
+3.3V: CORE (35 pins), POWER (C41.1 C42.2 D7.A VR1.2), CONNECTOR (JP10.1 JP10.2 R8.2), DEVICE (7 pins)
+3.3V_O: POWER (C44.1 C45.2 D8.A VR2.2), CONNECTOR (5 pins)
+5V: POWER (5 pins), CONNECTOR (JP1.6), DEVICE (C36.2 LCD1.28)
+5V_CH340G: CONNECTOR (ENABLE_CH340G.2), DEVICE (C37.1 IC1.16 R15.2 R16.2)
+5V_O: POWER (SW2.5), CONNECTOR (5 pins)
GND: CORE (43 pins), ST-LINK (20 pins), POWER (16 pins), CONNECTOR (31 pins), DEVICE (25 pins)
VIN_CH340G: POWER (USB_POWER_SELECT.3), CONNECTOR (D5.2 ENABLE_CH340G.1)
VIN_STLINK: ST-LINK (D2.2 ENABLE_STLINK.1), POWER (USB_POWER_SELECT.1)
VIN_USBOTG: POWER (USB_POWER_SELECT.5), CONNECTOR (JP1.2)
ADC_IN10_N: CORE (U1.33), CONNECTOR (JP11.8)
ADC_IN10_P: CORE (U1.32), CONNECTOR (JP11.7)
ADC_IN12_N: CORE (U1.35), CONNECTOR (JP11.10)
ADC_IN12_P: CORE (U1.34), CONNECTOR (JP11.9)
ADC_IN16_N: CORE (U1.41), CONNECTOR (JP11.4)
ADC_IN16_P: CORE (U1.40), CONNECTOR (JP11.3)
ADC_IN18_N: CORE (U1.51), CONNECTOR (JP11.6)
ADC_IN18_P: CORE (U1.50), CONNECTOR (JP11.5)
CH340G_N: CONNECTOR (USB2.2), DEVICE (IC1.6)
CH340G_P: CONNECTOR (USB2.3), DEVICE (IC1.5)
FSMC_A18: CORE (U1.101), DEVICE (LCD1.2)
FSMC_D0: CORE (U1.104), DEVICE (LCD1.6)
FSMC_D1: CORE (U1.105), DEVICE (LCD1.7)
FSMC_D2: CORE (U1.142), DEVICE (LCD1.8)
FSMC_D3: CORE (U1.143), DEVICE (LCD1.9)
FSMC_D4: CORE (U1.68), DEVICE (LCD1.10)
FSMC_D5: CORE (U1.69), DEVICE (LCD1.11)
FSMC_D6: CORE (U1.70), DEVICE (LCD1.12)
FSMC_D7: CORE (U1.73), DEVICE (LCD1.13)
FSMC_D8: CORE (U1.74), DEVICE (LCD1.14)
FSMC_D9: CORE (U1.75), DEVICE (LCD1.15)
FSMC_D10: CORE (U1.76), DEVICE (LCD1.16)
FSMC_D11: CORE (U1.77), DEVICE (LCD1.17)
FSMC_D12: CORE (U1.78), DEVICE (LCD1.18)
FSMC_D13: CORE (U1.96), DEVICE (LCD1.19)
FSMC_D14: CORE (U1.97), DEVICE (LCD1.20)
FSMC_D15: CORE (U1.98), DEVICE (LCD1.21)
FSMC_NE1: CORE (U1.151), DEVICE (LCD1.1)
FSMC_NOE: CORE (U1.146), DEVICE (LCD1.4)
FSMC_NWE: CORE (U1.147), DEVICE (LCD1.3)
LCD_BL: CORE (U1.119), DEVICE (LCD1.23)
NRST: CORE (5 pins), CONNECTOR (DEBUG_STM1.3), DEVICE (LCD1.5)
PA2: CORE (U1.3), CONNECTOR (JP4.19)
PA3: CORE (U1.128), CONNECTOR (JP4.2)
PA6: CORE (U1.129), CONNECTOR (JP4.3), DEVICE (C34.2 Rp1.1 SW1.B)
PA7: CORE (U1.1), CONNECTOR (JP4.18), DEVICE (C33.2 Rp1.2 SW1.A)
PA15: CORE (U1.138), CONNECTOR (JP4.7), DEVICE (Rp1.3 SW1.1)
PB0: CORE (U1.162), CONNECTOR (JP4.12)
PB1: CORE (U1.140), CONNECTOR (JP4.8)
PB2: CORE (U1.134), CONNECTOR (JP4.6)
PB3: CORE (U1.157), CONNECTOR (JP4.10)
PB4: CORE (U1.165), CONNECTOR (JP4.13)
PB5: CORE (U1.11), CONNECTOR (JP4.16)
PB6: CORE (U1.169), CONNECTOR (JP4.14)
PB7: CORE (U1.8), CONNECTOR (JP4.17)
PB8: CORE (U1.175), CONNECTOR (JP4.15)
PB9: CORE (U1.7), CONNECTOR (JP4.20)
PB10: CORE (U1.160), CONNECTOR (JP4.11)
PB11: CORE (U1.141), CONNECTOR (JP4.9)
PB12: CORE (U1.132), CONNECTOR (JP4.4)
PB13: CORE (U1.133), CONNECTOR (JP4.5)
PB14: CORE (U1.88), CONNECTOR (JP6.20)
PB15: CORE (U1.92), CONNECTOR (JP6.15)
PC4: CORE (U1.52), CONNECTOR (JP6.16)
PC5: CORE (U1.21), CONNECTOR (JP6.4)
PC6: CORE (U1.94), CONNECTOR (JP6.14)
PC7: CORE (U1.107), CONNECTOR (JP6.12)
PC8: CORE (U1.110), CONNECTOR (JP6.11)
PC9: CORE (U1.115), CONNECTOR (JP6.9)
PC10: CORE (U1.80), CONNECTOR (JP6.18)
PC11: CORE (U1.87), CONNECTOR (JP6.19)
PC12: CORE (U1.79), CONNECTOR (JP6.17)
PC13: CORE (U1.44), CONNECTOR (JP6.7)
PE0: CORE (U1.16), CONNECTOR (JP6.2), DEVICE (D12.A)
PE1: CORE (U1.18), CONNECTOR (JP6.3), DEVICE (SW4.2 SW4.3)
PE2: CORE (U1.56), CONNECTOR (JP6.10), DEVICE (SW5.2 SW5.3)
PE3: CORE (U1.47), CONNECTOR (JP6.8), DEVICE (SW6.2 SW6.3)
PE4: CORE (U1.59), CONNECTOR (JP6.13), DEVICE (SW7.2 SW7.3)
PE5: CORE (U1.25), CONNECTOR (JP6.5)
PE6: CORE (U1.28), CONNECTOR (JP6.6)
PF0: CORE (U1.112), CONNECTOR (JP7.11)
PF1: CORE (U1.109), CONNECTOR (JP7.9)
PF2: CORE (U1.106), CONNECTOR (JP7.10)
PF3: CORE (U1.24), CONNECTOR (JP7.15)
PF4: CORE (U1.58), CONNECTOR (JP7.8)
PF5: CORE (U1.55), CONNECTOR (JP7.12)
PF6: CORE (U1.54), CONNECTOR (JP7.14)
PF7: CORE (U1.27), CONNECTOR (JP7.17)
PF8: CORE (U1.19), CONNECTOR (JP7.18)
PF9: CORE (U1.46), CONNECTOR (JP7.2)
PF10: CORE (U1.43), CONNECTOR (JP7.1)
PF11: CORE (U1.17), CONNECTOR (JP7.19)
PF12: CORE (U1.12), CONNECTOR (JP7.16)
PF13: CORE (U1.63), CONNECTOR (JP7.7)
PF14: CORE (U1.86), CONNECTOR (JP7.3)
PF15: CORE (U1.65), CONNECTOR (JP7.6)
PG0: CORE (U1.66), CONNECTOR (JP7.5)
PG1: CORE (U1.67), CONNECTOR (JP7.4)
PG2: CORE (U1.117), CONNECTOR (JP7.13)
PG3: CORE (U1.89), CONNECTOR (JP8.19)
PG4: CORE (U1.93), CONNECTOR (JP8.16)
PG5: CORE (U1.95), CONNECTOR (JP8.15)
PG6: CORE (U1.108), CONNECTOR (JP8.13)
PG7: CORE (U1.111), CONNECTOR (JP8.12)
PG8: CORE (U1.116), CONNECTOR (JP8.11)
PG9: CORE (U1.118), CONNECTOR (JP8.9)
PG10: CORE (U1.13), CONNECTOR (JP8.5)
PG11: CORE (U1.60), CONNECTOR (JP8.10)
PG12: CORE (U1.85), CONNECTOR (JP8.20)
PG13: CORE (U1.57), CONNECTOR (JP8.8)
PG14: CORE (U1.20), CONNECTOR (JP8.3)
PG15: CORE (U1.64), CONNECTOR (JP8.14)
PH2: CORE (U1.45), CONNECTOR (JP8.7)
PH3: CORE (U1.42), CONNECTOR (JP8.4)
PH4: CORE (U1.26), CONNECTOR (JP8.2)
PH5: CORE (U1.53), CONNECTOR (JP8.6)
PH6: CORE (U1.83), CONNECTOR (JP8.18)
PH7: CORE (U1.84), CONNECTOR (JP8.17)
PH8: CORE (U1.164), CONNECTOR (JP9.10)
PH9: CORE (U1.152), CONNECTOR (JP9.17)
PH10: CORE (U1.168), CONNECTOR (JP9.8)
PH11: CORE (U1.131), CONNECTOR (JP9.19)
PH12: CORE (U1.130), CONNECTOR (JP9.20)
PH13: CORE (U1.139), CONNECTOR (JP9.18)
PH14: CORE (U1.153), CONNECTOR (JP9.16)
PH15: CORE (U1.154), CONNECTOR (JP9.15)
PI0: CORE (U1.156), CONNECTOR (JP9.13)
PI1: CORE (U1.163), CONNECTOR (JP9.11)
PI2: CORE (U1.155), CONNECTOR (JP9.14)
PI3: CORE (U1.161), CONNECTOR (JP9.12)
PI4: CORE (U1.173), CONNECTOR (JP9.6)
PI5: CORE (U1.174), CONNECTOR (JP9.5)
PI6: CORE (U1.167), CONNECTOR (JP9.9)
PI7: CORE (U1.176), CONNECTOR (JP9.4)
PI8: CORE (U1.4), CONNECTOR (JP9.1)
PI9: CORE (U1.170), CONNECTOR (JP9.7)
PI10: CORE (U1.5), CONNECTOR (JP9.3)
PI11: CORE (U1.2), CONNECTOR (JP9.2)
RXD_CH340: CORE (U1.120), DEVICE (JP12.4)
SWCLK: CORE (U1.137), CONNECTOR (DEBUG_STM1.2)
SWDIO: CORE (U1.124), CONNECTOR (DEBUG_STM1.1)
T_CLK: CORE (U1.144), DEVICE (LCD1.34)
T_CS: CORE (U1.99), DEVICE (LCD1.33)
T_JTCK: ST-LINK (U2.15 U2.26), CONNECTOR (DEBUG_STLINK1.2)
T_JTMS: ST-LINK (R6.1 U2.27), CONNECTOR (DEBUG_STLINK1.1)
T_MISO: CORE (U1.150), DEVICE (LCD1.29)
T_MOSI: CORE (U1.100), DEVICE (LCD1.30)
T_NRST: ST-LINK (U2.18), CONNECTOR (DEBUG_STLINK1.3)
T_PEN: CORE (U1.145), DEVICE (LCD1.31)
TXD_CH340: CORE (U1.121), DEVICE (JP12.2)
USB_OTG_N: CORE (U1.122), CONNECTOR (USB_OTP.2)
USB_OTG_P: CORE (U1.123), CONNECTOR (USB_OTP.3)